# EasyEDA Pro project FYP_Schematics.epro

# Schematic Schematic1
Board Name: Board1; Create Date: 2025-05-17; Page Name: P1; Project Name: Salman Project; Schematic Name: Schematic1; Update Date: 2025-05-18; Company: EasyEDA.com; Page Size: A4; Version: V1.0
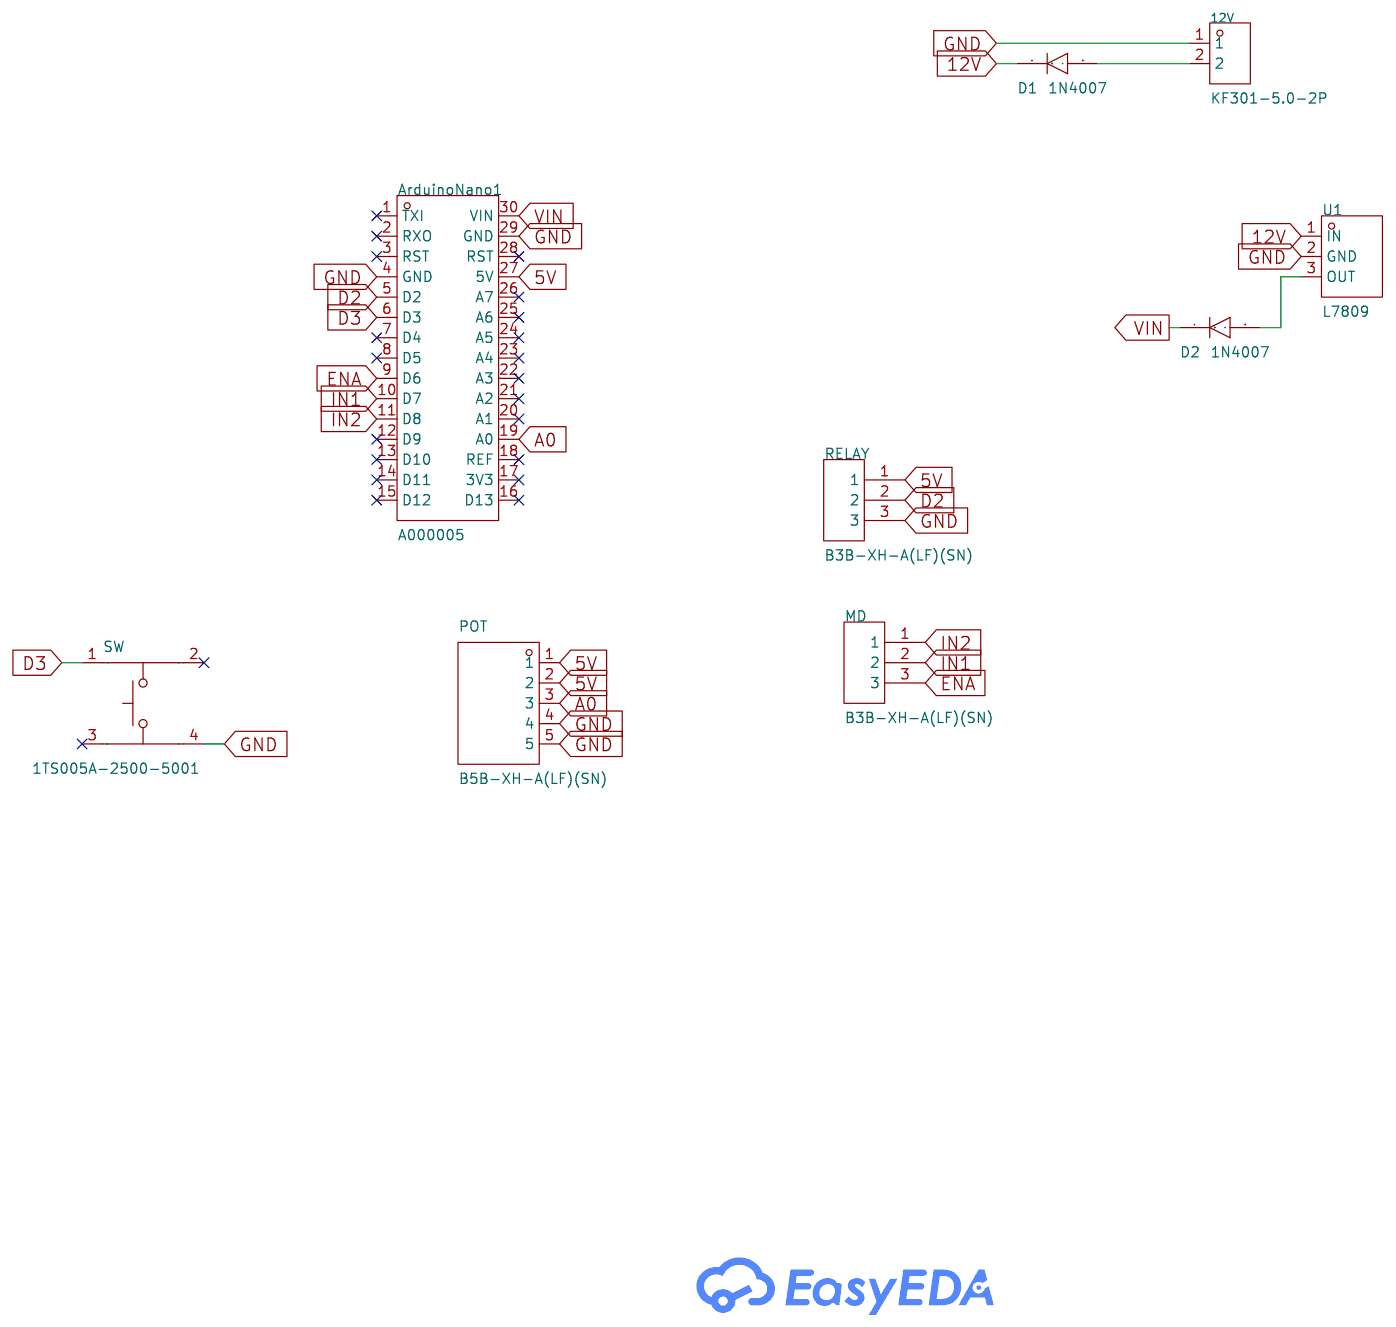
[diagram p0: schematic sheet]

## Parts
12V  KF301-5.0-2P  [CONN-TH_P5.00_KF301-5.0-2P]
ArduinoNano1  A000005  [COMM-TH_A000005]
D1  1N4007  [DO-41_BD2.4-L4.7-P8.70-D0.9-RD]
D2  1N4007  [DO-41_BD2.4-L4.7-P8.70-D0.9-RD]
MD  B3B-XH-A(LF)(SN)  [CONN-TH_3P-P2.50_A2501WV2-3P]
POT  B5B-XH-A(LF)(SN)  [CONN-TH_B5B-XH-A-LF-SN]
RELAY  B3B-XH-A(LF)(SN)  [CONN-TH_3P-P2.50_A2501WV2-3P]
SW  1TS005A-2500-5001  [SW-TH_4P-L6.0-W6.0-P3.90-LS6.5]
U1  L7809  [TO-220-3_L10.0-W4.5-P2.54-L]

## Library data of the parts
12V = KF301-5.0-2P: Structure:1x2P Pitch:5mm Color:Blue Mounting Style:Straight Current Rating (Max):17A Voltage Rating (Max):250V Number of Pins:2P Number of Rows:1 Wire Gauge - AWG:14~22 Wire Gauge - AWG:14~22 Wire Gauge - mm2:1.5 Wire Gauge - mm2:1.5 Number of PINs Per Ro; LCSC Part Name: 5mm 1x2P 排数:1 每排P数:2 直插; Supplier Part: C474881; Manufacturer: KEFA(科发); Supplier Footprint: 插件,P=5mm; JLCPCB Part Class: Extended Part; Datasheet: https://atta.szlcsc.com/upload/public/pdf/source/20230317/03A5B5FC229D6F9225E8F51DA1A4E80A.pdf; Supplier: LCSC; Structure: 1x2P; Pitch: 5mm; Color: Blue; Mounting Style: Straight; Current Rating (Max): 17A; Voltage Rating (Max): 250V; Number of Pins: 2P; Number of Rows: 1; Wire Gauge - AWG: 14~22; Wire Gauge - mm2: 1.5; Number of PINs Per Row: 2; Operating Temperature Range: -30℃~+120℃
ArduinoNano1 = A000005: Supplier Part: C19189484; Manufacturer: arduino; JLCPCB Part Class: Extended Part; Datasheet: https://atta.szlcsc.com/upload/public/pdf/source/20240327/42B4B7387607EBC2A03270056B7E63CD.pdf; Supplier: LCSC
D1 D2 = 1N4007_C84641: Diode Configuration:- Voltage - Forward(Vf@If):1.1V@1A Voltage - DC Reverse(Vr): Current - Rectified: Reverse Leakage Current (Ir):5uA@1kV; Supplier Part: C84641; Manufacturer: 星海; Supplier Footprint: DO-41; JLCPCB Part Class: Extended Part; Datasheet: https://atta.szlcsc.com/upload/public/pdf/source/20171026/C84641_15089842760411059271.pdf; Supplier: LCSC; Voltage - Forward(Vf@If): 1.1V@1A; Reverse Leakage Current (Ir): 5uA@1kV
MD RELAY = B3B-XH-A(LF)(SN): Pins Structure:1x3P Pitch:2.5mm Mounting Style:Direct Insert Reference Series:XH Number of Pins:3P Number of Rows:1 Number of PINs Per Row:3 Row Spacing:- Current Rating (Max):3A Contact Material:Brass Contact Plating:Tin Operating Temperature Range:-25℃~; LCSC Part Name: 1x3P 间距:2.5mm 直插 系列:XH; Supplier Part: C144394; Manufacturer: JST; Supplier Footprint: 插件,P=2.5mm; JLCPCB Part Class: Extended Part; Datasheet: https://atta.szlcsc.com/upload/public/pdf/source/20180928/C265283_F9DFEEBDB2CF642B6BDFAB4B77BD2680.pdf; Supplier: LCSC; Pins Structure: 1x3P; Pitch: 2.5mm; Mounting Style: Direct Insert; Reference Series: XH; Number of Pins: 3P; Number of Rows: 1; Number of PINs Per Row: 3; Current Rating (Max): 3A; Contact Material: Brass; Contact Plating: Tin; Operating Temperature Range: -25℃~+85℃; Rated Voltage (Max): 250V; Plastic Material: PA66; Flame Retardant Rating: UL94V-0; Supplementary Features: K-leg punch; Colour: White; Z-Height of the Board: 7mm; X-Length of Bottom Edge on Board (Spacing Line): 9.9mm; Y-Width of Bottom Edge on Board: 5.75mm
POT = B5B-XH-A(LF)(SN): Pins Structure:1x5P Pitch:2.5mm Mounting Style:Direct Insert Reference Series:XH Number of Pins:5P Number of Rows:1 Number of PINs Per Row:5 Row Spacing:- Current Rating (Max):3A Contact Material:Brass Contact Plating:Tin Operating Temperature Range:-25℃~; LCSC Part Name: 1x5P 间距:2.5mm 直插 系列:XH; Supplier Part: C157991; Manufacturer: JST; Supplier Footprint: 插件,P=2.5mm; JLCPCB Part Class: Extended Part; Datasheet: https://atta.szlcsc.com/upload/public/pdf/source/20180928/C265283_F9DFEEBDB2CF642B6BDFAB4B77BD2680.pdf; Supplier: LCSC; Pins Structure: 1x5P; Pitch: 2.5mm; Mounting Style: Direct Insert; Reference Series: XH; Number of Pins: 5P; Number of Rows: 1; Number of PINs Per Row: 5; Current Rating (Max): 3A; Contact Material: Brass; Contact Plating: Tin; Operating Temperature Range: -25℃~+85℃; Rated Voltage (Max): 250V; Plastic Material: PA66; Flame Retardant Rating: UL94V-0; Supplementary Features: K-leg punch; Colour: White; Z-Height of the Board: 7mm; X-Length of Bottom Edge on Board (Spacing Line): 14.9mm; Y-Width of Bottom Edge on Board: 5.75mm
SW = 1TS005A-2500-5001: Circuit:SPST Actuator Style:Round Button Operating Force:250gf Mounting Style:Straight Switch Length:6mm Switch Width:6mm Switch Height:5mm Strike Gundam:不带 Contact Current:50mA Voltage Rating (DC):12V Power Rating:0.6W Insulation Resistance:100MΩ Actuato; LCSC Part Name: 6*6*5mm 直插 轻触开关; Supplier Part: C255811; Manufacturer: HYP(鸿源精密); Supplier Footprint: 插件,6x6mm; JLCPCB Part Class: Extended Part; Datasheet: https://atta.szlcsc.com/upload/public/pdf/source/20180720/C255811_DA12C4E3C20854D48E888AEA64926F5F.pdf; Supplier: LCSC; Circuit: SPST; Actuator Style: Round Button; Operating Force: 250gf; Mounting Style: Straight; Switch Length: 6mm; Switch Width: 6mm; Switch Height: 5mm; Strike Gundam: 不带; Contact Current: 50mA; Voltage Rating (DC): 12V; Power Rating: 0.6W; Insulation Resistance: 100MΩ; Actuator/Cap Color: Black; With Lamp: No; Pin Style: PCPin; Mechanical Life: 7万次; Operating Temperature: -40℃~+90℃
U1 = L7809: Output Type:Fixed Voltage - Supply:35V Output Voltage:9V Output Voltage:9V Output Current:1.5A Power Supply Rejection Ratio (PSRR):66dB@(120Hz) Voltage Dropout:2V@(1A) standby current:8mA Noise:58uVrms Features:- Operating Temperature:-20℃~+125℃@(Tj) Oper; LCSC Part Name: 输入35V 输出9V 1.5A; Supplier Part: C2843719; Manufacturer: PUOLOP(迪浦); Supplier Footprint: TO-220; JLCPCB Part Class: Extended Part; Datasheet: https://atta.szlcsc.com/upload/public/pdf/source/20210712/C2843719_EB9C94D3858B4F90CCD511153E097D54.pdf; Supplier: LCSC; Output Type: Fixed; Voltage - Supply: 35V; Output Voltage: 9V; Output Current: 1.5A; Power Supply Rejection Ratio (PSRR): 66dB@(120Hz); Voltage Dropout: 2V@(1A); standby current: 8mA; Noise: 58uVrms; Operating Temperature: -20℃~+125℃@(Tj); Output Configuration: Positive electrode; Number of Outputs: 1

## Nets
5V: ArduinoNano1.27(5V) POT.1 POT.2 RELAY.1
12V: D1.1(C) U1.1(IN)
GND: 12V.1 ArduinoNano1.4(GND) ArduinoNano1.29(GND) POT.4 POT.5 RELAY.3 SW.4 U1.2(GND)
VIN: ArduinoNano1.30(VIN) D2.1(C)
A0: ArduinoNano1.19(A0) POT.3
D2: ArduinoNano1.5(D2) RELAY.2
D3: ArduinoNano1.6(D3) SW.1
ENA: ArduinoNano1.9(D6) MD.3
IN1: ArduinoNano1.10(D7) MD.2
IN2: ArduinoNano1.11(D8) MD.1
$1N783: 12V.2 D1.2(A)
$1N863: D2.2(A) U1.3(OUT)

Not connected (* = marked no-connect by the designer): ArduinoNano1 1(TXI)* 2(RXO)* 3(RST)* 7(D4)* 8(D5)* 12(D9)* 13(D10)* 14(D11)* 15(D12)* 16(D13)* 17(3V3)* 18(REF)* 20(A1)* 21(A2)* 22(A3)* 23(A4)* 24(A5)* 25(A6)* 26(A7)* 28(RST)*; SW 2* 3*

# Board PCB1
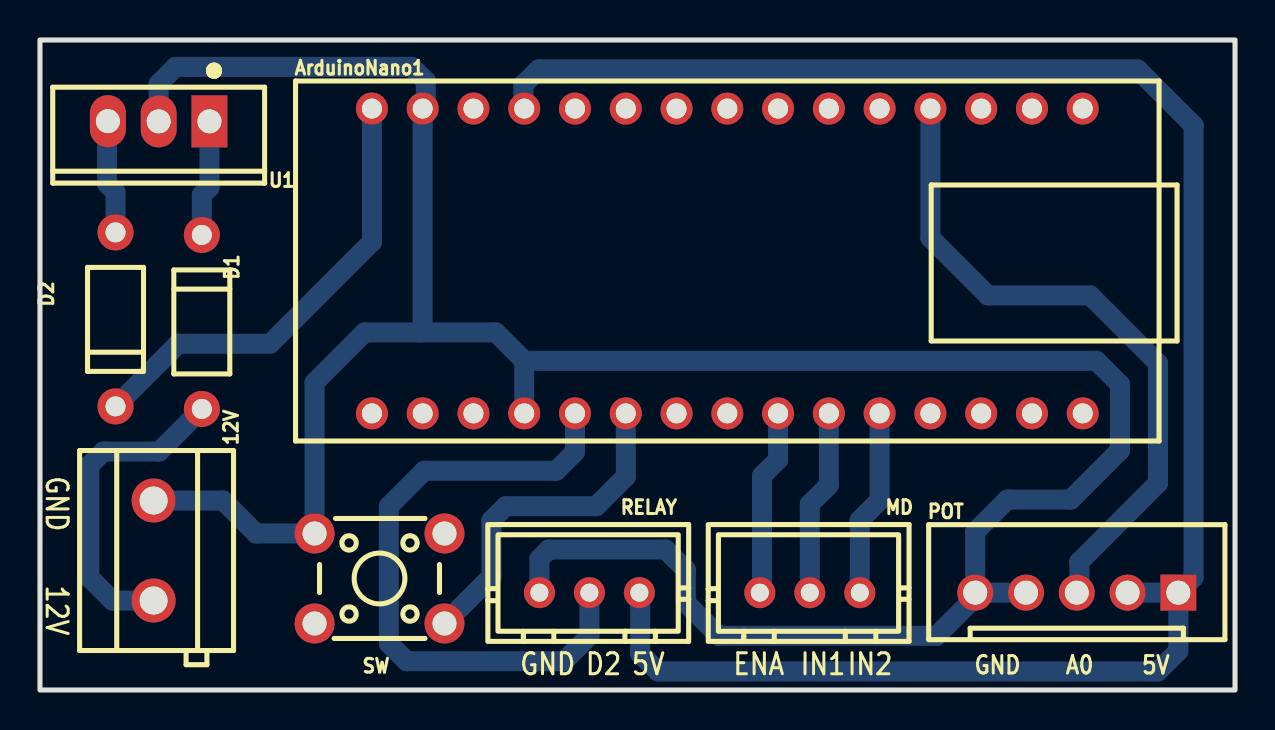
[diagram p1: board, top side]
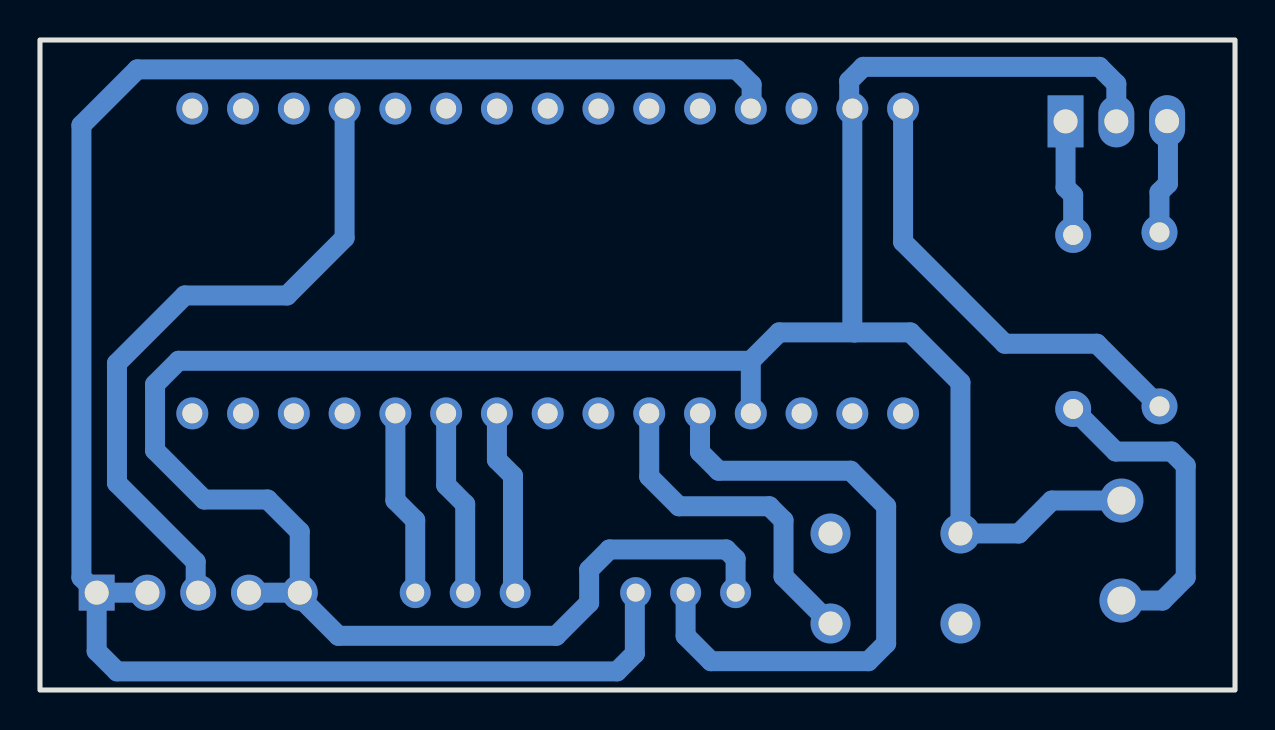
[diagram p2: board, bottom side, seen from below]

Outline 59.79 x 32.5 mm; copper layers: Top Layer, Bottom Layer. Coordinates in mm from the lower left corner of the outline.
Outline path: rectangle 59.79,32.5 0,0
Stack: Top Layer 0.035mm / Dielectric1 1.51mm FR4 er 4.5 / Bottom Layer 0.035mm

## Design rules (mm)
template: Custom Config
spacing copperThickness1oz (default): track to track 0.102, other pairs 0.152 to 0.3
spacing copperThickness2oz: track to track 0.203, other pairs 0.152 to 0.3
track width copperThickness1oz (default): min 0.127, default 1, max 2.54
track width copperThickness2oz: min 0.203, default 0.254, max 2.54
differential pair differentialPair (default): width min 0.127, default 0.254, max 2.54; gap min 0.152, default 0.152
via viaSize (default): diameter min 0.5, default 0.61, max 10; hole min 0.3, default 0.305, max 6.3

## Placement (name value [footprint] x y rotation side)
12V  KF301-5.0-2P  [CONN-TH_P5.00_KF301-5.0-2P]  5.68 6.97 270 top
ArduinoNano1  A000005  [COMM-TH_A000005]  34.39 21.45 0 top
D1  1N4007  [DO-41_BD2.4-L4.7-P8.70-D0.9-RD]  8.1 18.4 270 top
D2  1N4007  [DO-41_BD2.4-L4.7-P8.70-D0.9-RD]  3.78 18.53 90 top
MD  B3B-XH-A(LF)(SN)  [CONN-TH_3P-P2.50_A2501WV2-3P]  38.51 4.87 180 top
POT  B5B-XH-A(LF)(SN)  [CONN-TH_B5B-XH-A-LF-SN]  51.87 4.87 0 top
RELAY  B3B-XH-A(LF)(SN)  [CONN-TH_3P-P2.50_A2501WV2-3P]  27.49 4.87 180 top
SW  1TS005A-2500-5001  [SW-TH_4P-L6.0-W6.0-P3.90-LS6.5]  16.99 5.58 180 top
U1  L7809  [TO-220-3_L10.0-W4.5-P2.54-L]  5.94 28.44 180 top

## Footprints (pads in the part's own frame, mm; a bottom-side part is the same pattern mirrored in y, then rotated)
COMM-TH_A000005
  round 1.6 hole 1: 1(-17.78,-7.62) 2(-15.24,-7.62) 3(-12.7,-7.62) 4(-10.16,-7.62) 5(-7.62,-7.62) 6(-5.08,-7.62) 7(-2.54,-7.62) 8(0,-7.62) 9(2.54,-7.62) 10(5.08,-7.62) 11(7.62,-7.62) 12(10.16,-7.62) 13(12.7,-7.62) 14(15.24,-7.62) 15(17.78,-7.62) 16(17.78,7.62) 17(15.24,7.62) 18(12.7,7.62) 19(10.16,7.62) 20(7.62,7.62) 21(5.08,7.62) 22(2.54,7.62) 23(0,7.62) 24(-2.54,7.62) 25(-5.08,7.62) 26(-7.62,7.62) 27(-10.16,7.62) 28(-12.7,7.62) 29(-15.24,7.62) 30(-17.78,7.62)
CONN-TH_3P-P2.50_A2501WV2-3P
  round 1.55 hole 0.9: 1(-2.5,0) 2(0,0) 3(2.5,0)
CONN-TH_B5B-XH-A-LF-SN
  rect 1.8x1.8 hole 1.2: 1(5.08,0)
  round 1.8 hole 1.2: 2(2.54,0) 3(0,0) 4(-2.54,0) 5(-5.08,0)
CONN-TH_P5.00_KF301-5.0-2P
  round 2.2 hole 1.4: 1(-2.5,0) 2(2.5,0)
DO-41_BD2.4-L4.7-P8.70-D0.9-RD
  round 1.8 hole 1: 1(-4.35,0) 2(4.35,0)
SW-TH_4P-L6.0-W6.0-P3.90-LS6.5
  round 2 hole 1.2: 1(-3.25,2.25) 2(3.25,2.25) 3(-3.25,-2.25) 4(3.25,-2.25)
TO-220-3_L10.0-W4.5-P2.54-L
  rect 1.8x2.6 hole 1.2: 1(-2.54,0.005)
  oval 1.8x2.6 hole 1.2: 2(0,0.005) 3(2.54,-0.005)

## Nets
As in the schematic.

Pads without a net: ArduinoNano1 1 2 3 7 8 12 13 14 15 16 17 18 20 21 22 23 24 25 26 28; SW 2 3

## Routing (per net, layer and track width the routed paths; a pad name or vN(x,y) marks a point on that pad's centre or on a via; arc(x,y) is an arc through that point)
5V: length 96.1
  Bottom Layer w1: RELAY.1 30.03,4.83 30.03,1.82 30.92,0.93 55.93,0.93 56.95,1.95 POT.1 ; POT.1 57.71,5.63 57.71,28.24 54.92,31.03 24.95,31.03 24.18,30.27 24.18,29.11 ArduinoNano1.27 ; POT.1 POT.2
12V: length 5.8
  Bottom Layer w1: U1.1 8.48,25.13 8.1,24.74 8.1,22.75
GND: length 135.2
  Bottom Layer w1: RELAY.3 24.99,6.56 25.45,7.03 31.3,7.03 32.31,6.01 32.31,4.36 33.96,2.71 44.86,2.71 46.79,4.64 POT.5 ; 24.23,16.46 52.85,16.46 54.03,15.28 54.03,11.98 51.57,9.52 48.4,9.52 46.79,7.92 POT.5 ; 24.23,16.46 ArduinoNano1.4 ; 24.23,16.46 22.81,17.88 19.04,17.88 ; 12V.1 9.17,9.47 10.81,7.83 SW.4 13.74,15.38 16.24,17.88 19.04,17.88 ; POT.5 POT.4 ; 19.04,17.88 19.15,17.98 ArduinoNano1.29 19.3,29.23 19.3,30.45 18.6,31.16 6.79,31.16 5.94,30.31 U1.2
VIN: length 22.9
  Bottom Layer w1: ArduinoNano1.30 16.61,22.4 11.52,17.31 6.91,17.31 D2.1
A0: length 33.6
  Bottom Layer w1: POT.3 52,4.99 52,6.41 55.93,10.35 55.93,16.33 52.54,19.73 47.43,19.73 44.55,22.61 ArduinoNano1.19
D2: length 32.3
  Bottom Layer w1: ArduinoNano1.5 26.77,11.89 25.84,10.96 19.23,10.96 17.45,9.19 17.45,2.33 18.34,1.44 26.22,1.44 27.49,2.71 RELAY.2
D3: length 16.9
  Bottom Layer w1: SW.1 22.59,5.68 22.59,8.48 23.3,9.19 27.82,9.19 29.31,10.67 ArduinoNano1.6
ENA: length 9.3
  Bottom Layer w1: ArduinoNano1.9 36.93,11.51 36.12,10.71 36.12,4.98 MD.3
IN1: length 9.4
  Bottom Layer w1: MD.2 38.51,9.29 39.47,10.24 ArduinoNano1.10
IN2: length 9.4
  Bottom Layer w1: ArduinoNano1.11 42.01,9.48 41.01,8.49 MD.1
$1N783: length 16.1
  Bottom Layer w1: D1.2 5.97,11.92 3.17,11.92 2.47,11.22 2.47,5.63 3.62,4.47 12V.2
$1N863: length 5.8
  Bottom Layer w1: D2.2 3.78,24.89 3.36,25.31 3.36,28.4 3.4,28.44

## Text on the board
Top Silkscreen Layer: GND | A0 | 5V | D2 | ENA | IN1 | IN2 | 12V
